# Altium schematic sheet CORE.SchDoc
size A3
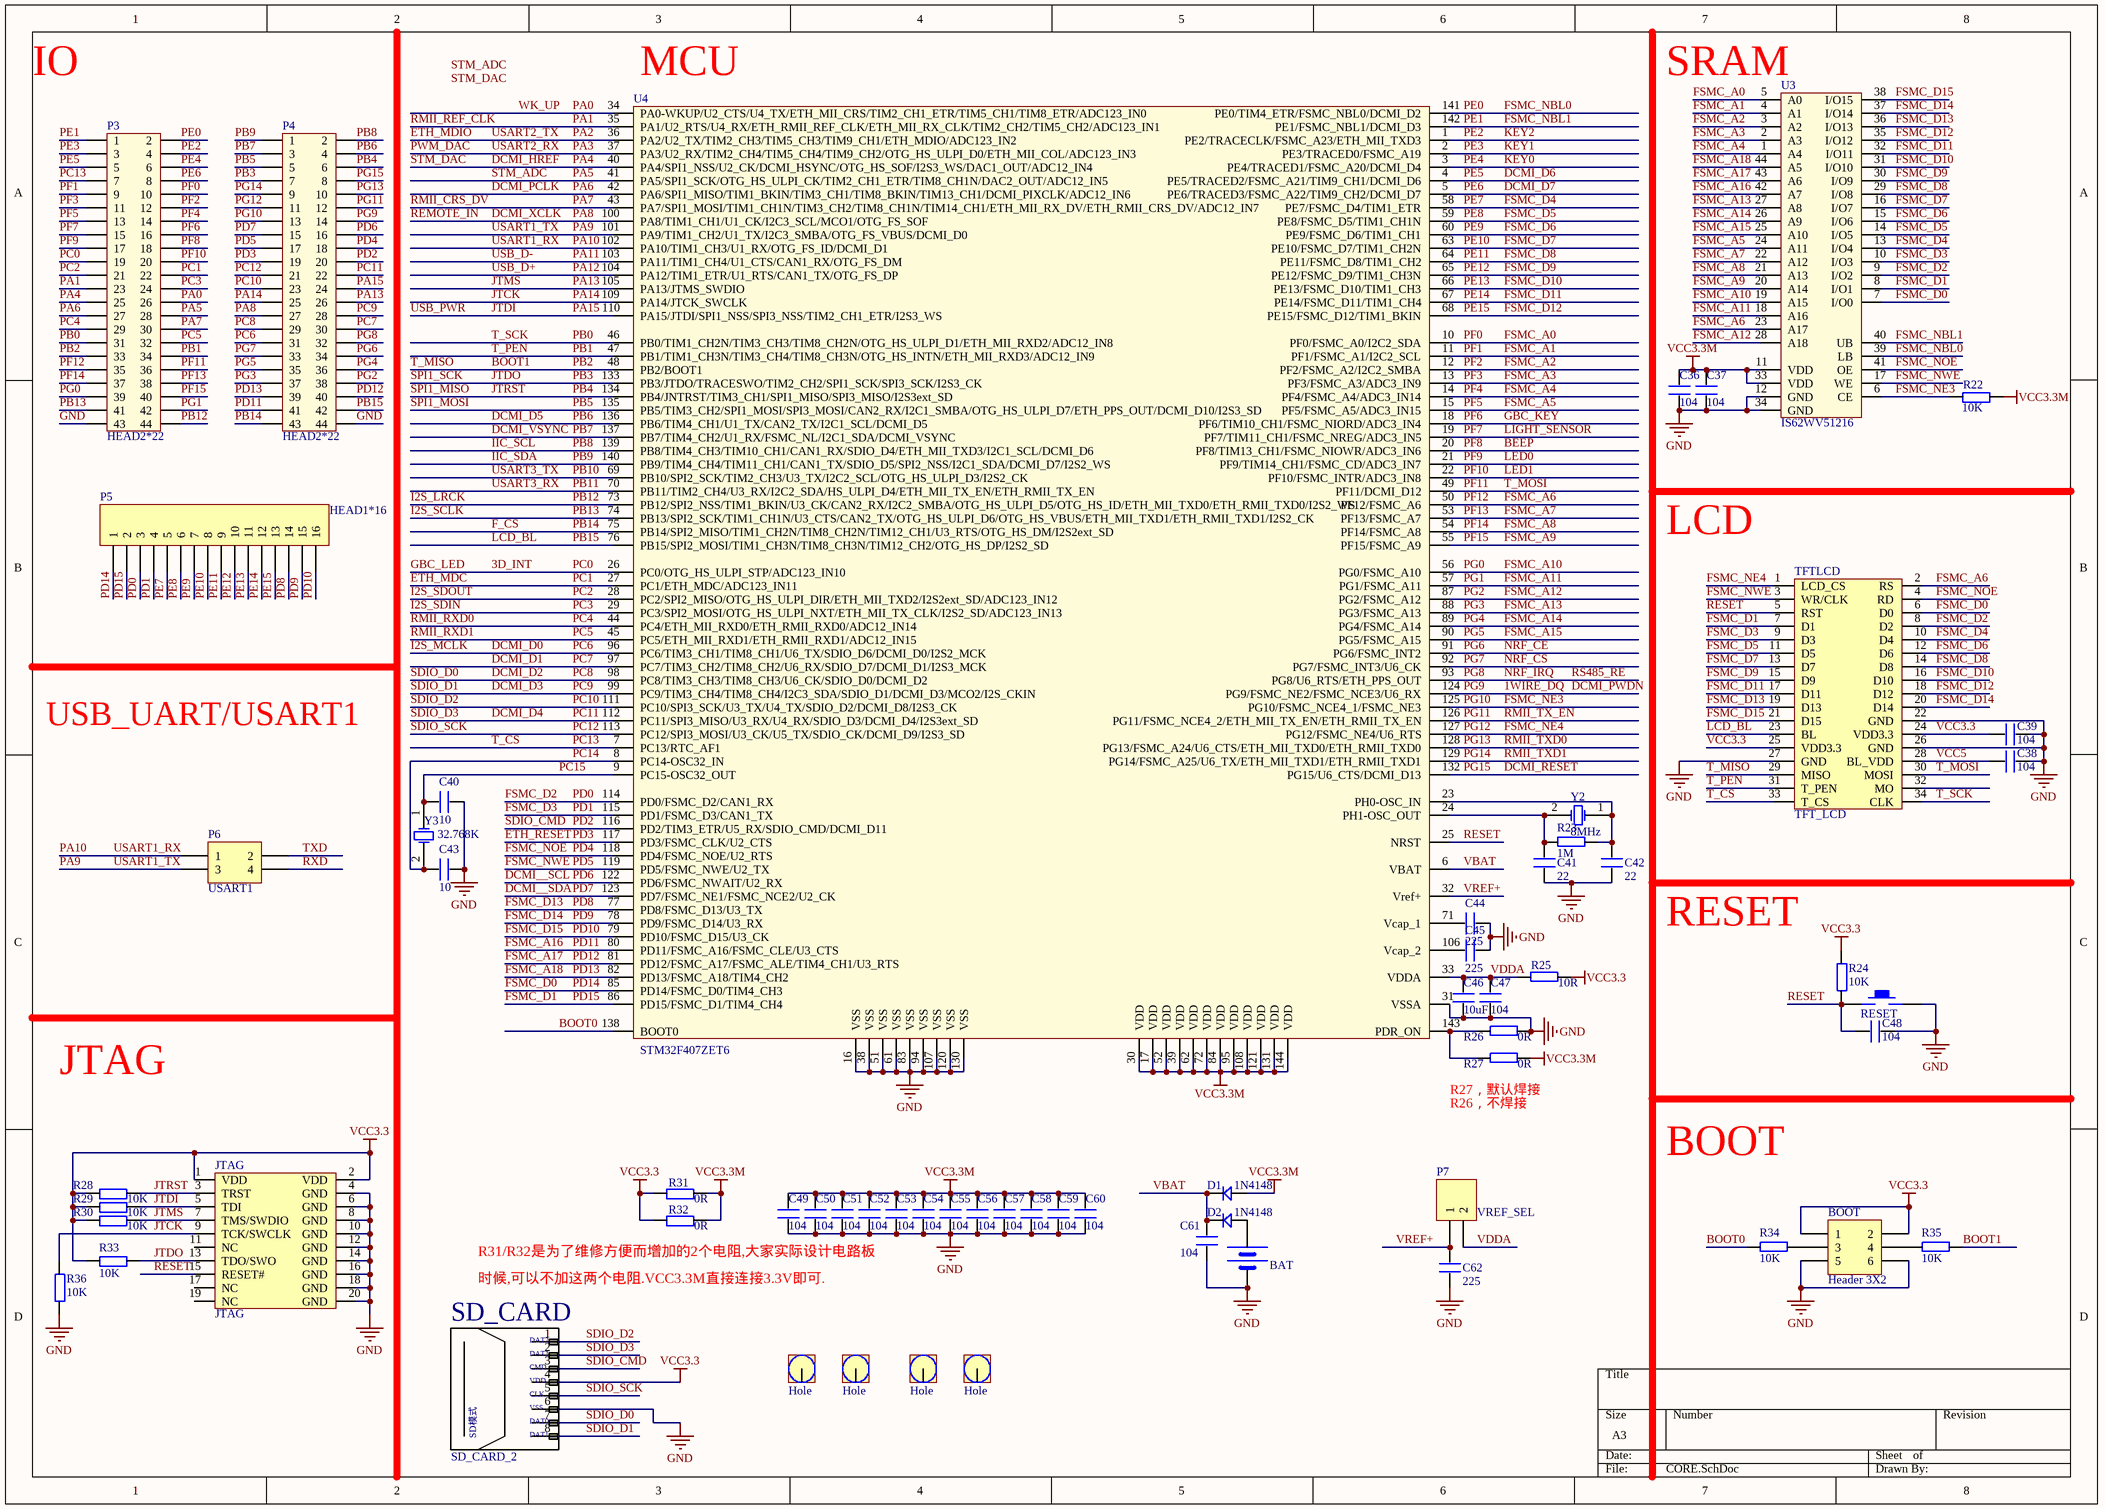
[diagram p0: CORE.SchDoc]

## Parts
BAT  BATT  [BATM]  (value not drawn)
BOOT  Header 3X2  [HDR2X3]
C36  104  [R0603]
C37  104  [R0603]
C38  104  [R0603]
C39  104  [R0603]
C40  10  [R0603]
C41  22  [R0603]
C42  22  [R0603]
C43  10  [R0603]
C44  225  [R0603]
C45  225  [R0603]
C46  10uF  [1206]
C47  104  [R0603]
C48  104  [R0603]
C49  104  [R0603]
C50  104  [R0603]
C51  104  [R0603]
C52  104  [R0603]
C53  104  [R0603]
C54  104  [R0603]
C55  104  [R0603]
C56  104  [R0603]
C57  104  [R0603]
C58  104  [R0603]
C59  104  [R0603]
C60  104  [R0603]
C61  104  [R0603]
C62  225  [R0603]
D1  1N4148  [DIODE_SOP]
D2  1N4148  [DIODE_SOP]
H1  Hole  [Hole_4.3Y]
H2  Hole  [Hole_4.3Y]
H3  Hole  [Hole_4.3Y]
H4  Hole  [Hole_4.3Y]
JTAG  JTAG  [JTAG_20]
P3  HEAD2*22  [HEAD2*22]
P4  HEAD2*22  [HEAD2*22]
P5  HEAD1*16  [HDR1X16]
P6  USART1  [HDR2X2]
P7  VREF_SEL  [HDR1X2]
R22  10K  [R0603]
R23  1M  [R0603]
R24  10K  [R0603]
R25  10R  [R0603]
R26  0R  [R0603]
R27  0R  [R0603]
R28  10K  [R0603]
R29  10K  [R0603]
R30  10K  [R0603]
R31  0R  [R0603]
R32  0R  [R0603]
R33  10K  [R0603]
R34  10K  [R0603]
R35  10K  [R0603]
R36  10K  [R0603]
RESET  KEY_M  [KEY_M]  (value not drawn)
SD_CARD_2  存储器接口  [TF_CARD_2]  (value not drawn)
TFTLCD  TFT_LCD  [db2*17-4.3]
U3  IS62WV51216  [TSOP44]
U4  STM32F407ZET6  [LQFP144]
Y2  8MHz  [XTAL_US]
Y3  32.768K  [XTAL32]

## Nets
GND: BAT.2(GND) BOOT.5 BOOT.6 C36.2 C37.2 C38.2 C39.2 C40.1 C41.2 C42.2 C43.1 C44.2 C45.2 C46.1 C47.1 C48.1 C49.1 C50.1 C51.1 C52.1 C53.1 C54.1 C55.1 C56.1 C57.1 C58.1 C59.1 C60.1 C61.2 C62.2 JTAG.4(GND) JTAG.6(GND) JTAG.8(GND) JTAG.10(GND) JTAG.12(GND) JTAG.14(GND) JTAG.16(GND) JTAG.18(GND) JTAG.20(GND) P3.43 P4.44 R26.1 R36.1 RESET.2 SD_CARD_2.6(VSS) TFTLCD.22(GND) TFTLCD.26(GND) TFTLCD.27(GND) U3.12(GND) U3.34(GND) U4.16(VSS) U4.31(VSSA) U4.38(VSS) U4.51(VSS) U4.61(VSS) U4.83(VSS) U4.94(VSS) U4.107(VSS) U4.120(VSS) U4.130(VSS)
VCC3.3: BOOT.1 BOOT.2 C39.1 JTAG.1(VDD) JTAG.2(VDD) R24.2 R25.1 R28.1 R29.1 R30.1 R31.1 R32.1 R33.1 SD_CARD_2.4(VDD) TFTLCD.24(VDD3.3) TFTLCD.25(VDD3.3)
VCC3.3M: C36.1 C37.1 C49.2 C50.2 C51.2 C52.2 C53.2 C54.2 C55.2 C56.2 C57.2 C58.2 C59.2 C60.2 D1.1 R22.2 R27.1 R31.2 R32.2 U3.11(VDD) U3.33(VDD) U4.17(VDD) U4.30(VDD) U4.39(VDD) U4.52(VDD) U4.62(VDD) U4.72(VDD) U4.84(VDD) U4.95(VDD) U4.108(VDD) U4.121(VDD) U4.131(VDD) U4.144(VDD)
1WIRE_DQ: P4.14 U4.124(PG9/FSMC_NE2/FSMC_NCE3/U6_RX)  [also labelled DCMI_PWDN, PG9]
3D_INT: P3.19 U4.26(PC0/OTG_HS_ULPI_STP/ADC123_IN10)  [also labelled GBC_LED, PC0]
BEEP: P3.18 U4.20(PF8/TIM13_CH1/FSMC_NIOWR/ADC3_IN6)  [also labelled PF8]
BOOT0: R34.2 U4.138(BOOT0)
BOOT1: P3.33 R35.1 TFTLCD.29(MISO) U4.48(PB2/BOOT1)  [also labelled PB2, T_MISO]
DCMI__SCL: P4.16 U4.122(PD6/FSMC_NWAIT/U2_RX)  [also labelled PD6]
DCMI__SDA: P4.15 U4.123(PD7/FSMC_NE1/FSMC_NCE2/U2_CK)  [also labelled PD7]
DCMI_D0: P4.31 U4.96(PC6/TIM3_CH1/TIM8_CH1/U6_TX/SDIO_D6/DCMI_D0/I2S2_MCK)  [also labelled I2S_MCLK, PC6]
DCMI_D1: P4.30 U4.97(PC7/TIM3_CH2/TIM8_CH2/U6_RX/SDIO_D7/DCMI_D1/I2S3_MCK)  [also labelled PC7]
DCMI_D2: P4.29 SD_CARD_2.7(DAT0/DO) U4.98(PC8/TIM3_CH3/TIM8_CH3/U6_CK/SDIO_D0/DCMI_D2)  [also labelled PC8, SDIO_D0]
DCMI_D3: P4.28 SD_CARD_2.8(DAT1/X) U4.99(PC9/TIM3_CH4/TIM8_CH4/I2C3_SDA/SDIO_D1/DCMI_D3/MCO2/I2S_CKIN)  [also labelled PC9, SDIO_D1]
DCMI_D4: P4.22 SD_CARD_2.2(CD/DAT3/CS) U4.112(PC11/SPI3_MISO/U3_RX/U4_RX/SDIO_D3/DCMI_D4/I2S3ext_SD)  [also labelled PC11, SDIO_D3]
DCMI_D5: P4.4 U4.136(PB6/TIM4_CH1/U1_TX/CAN2_TX/I2C1_SCL/DCMI_D5)  [also labelled PB6]
DCMI_D6: P3.5 U4.4(PE5/TRACED2/FSMC_A21/TIM9_CH1/DCMI_D6)  [also labelled PE5]
DCMI_D7: P3.8 U4.5(PE6/TRACED3/FSMC_A22/TIM9_CH2/DCMI_D7)  [also labelled PE6]
DCMI_HREF: P3.25 U4.40(PA4/SPI1_NSS/U2_CK/DCMI_HSYNC/OTG_HS_SOF/I2S3_WS/DAC1_OUT/ADC12_IN4)  [also labelled PA4, STM_DAC]
DCMI_PCLK: P3.27 U4.42(PA6/SPI1_MISO/TIM1_BKIN/TIM3_CH1/TIM8_BKIN/TIM13_CH1/DCMI_PIXCLK/ADC12_IN6)  [also labelled PA6]
DCMI_RESET: P4.8 U4.132(PG15/U6_CTS/DCMI_D13)  [also labelled PG15]
DCMI_VSYNC: P4.3 U4.137(PB7/TIM4_CH2/U1_RX/FSMC_NL/I2C1_SDA/DCMI_VSYNC)  [also labelled PB7]
DCMI_XCLK: P4.27 U4.100(PA8/TIM1_CH1/U1_CK/I2C3_SCL/MCO1/OTG_FS_SOF)  [also labelled PA8, REMOTE_IN]
ETH_MDC: P3.22 U4.27(PC1/ETH_MDC/ADC123_IN11)  [also labelled PC1]
ETH_MDIO: U4.36(PA2/U2_TX/TIM2_CH3/TIM5_CH3/TIM9_CH1/ETH_MDIO/ADC123_IN2)  [also labelled PA2, USART2_TX]
ETH_RESET: P4.19 U4.117(PD3/FSMC_CLK/U2_CTS)  [also labelled PD3]
F_CS: P4.43 U4.75(PB14/SPI2_MISO/TIM1_CH2N/TIM8_CH2N/TIM12_CH1/U3_RTS/OTG_HS_DM/I2S2ext_SD)  [also labelled PB14]
FSMC_A0: P3.10 U3.5(A0) U4.10(PF0/FSMC_A0/I2C2_SDA)  [also labelled PF0]
FSMC_A1: P3.9 U3.4(A1) U4.11(PF1/FSMC_A1/I2C2_SCL)  [also labelled PF1]
FSMC_A2: P3.12 U3.3(A2) U4.12(PF2/FSMC_A2/I2C2_SMBA)  [also labelled PF2]
FSMC_A3: P3.11 U3.2(A3) U4.13(PF3/FSMC_A3/ADC3_IN9)  [also labelled PF3]
FSMC_A4: P3.14 U3.1(A4) U4.14(PF4/FSMC_A4/ADC3_IN14)  [also labelled PF4]
FSMC_A5: P3.13 U3.24(A11) U4.15(PF5/FSMC_A5/ADC3_IN15)  [also labelled PF5]
FSMC_A6: P3.35 TFTLCD.2(RS) U3.23(A17) U4.50(PF12/FSMC_A6)  [also labelled PF12]
FSMC_A7: P3.38 U3.22(A12) U4.53(PF13/FSMC_A7)  [also labelled PF13]
FSMC_A8: P3.37 U3.21(A13) U4.54(PF14/FSMC_A8)  [also labelled PF14]
FSMC_A9: P3.40 U3.20(A14) U4.55(PF15/FSMC_A9)  [also labelled PF15]
FSMC_A10: P3.39 U3.19(A15) U4.56(PG0/FSMC_A10)  [also labelled PG0]
FSMC_A11: P3.42 U3.18(A16) U4.57(PG1/FSMC_A11)  [also labelled PG1]
FSMC_A12: P4.38 U3.28(A18) U4.87(PG2/FSMC_A12)  [also labelled PG2]
FSMC_A13: P4.37 U3.27(A8) U4.88(PG3/FSMC_A13)  [also labelled PG3]
FSMC_A14: P4.36 U3.26(A9) U4.89(PG4/FSMC_A14)  [also labelled PG4]
FSMC_A15: P4.35 U3.25(A10) U4.90(PG5/FSMC_A15)  [also labelled PG5]
FSMC_A16: P4.41 U3.42(A7) U4.80(PD11/FSMC_A16/FSMC_CLE/U3_CTS)  [also labelled PD11]
FSMC_A17: P4.40 U3.43(A6) U4.81(PD12/FSMC_A17/FSMC_ALE/TIM4_CH1/U3_RTS)  [also labelled PD12]
FSMC_A18: P4.39 U3.44(A5) U4.82(PD13/FSMC_A18/TIM4_CH2)  [also labelled PD13]
FSMC_D0: P5.1 TFTLCD.6(D0) U3.7(I/O0) U4.85(PD14/FSMC_D0/TIM4_CH3)  [also labelled PD14]
FSMC_D1: P5.2 TFTLCD.7(D1) U3.8(I/O1) U4.86(PD15/FSMC_D1/TIM4_CH4)  [also labelled PD15]
FSMC_D2: P5.3 TFTLCD.8(D2) U3.9(I/O2) U4.114(PD0/FSMC_D2/CAN1_RX)  [also labelled PD0]
FSMC_D3: P5.4 TFTLCD.9(D3) U3.10(I/O3) U4.115(PD1/FSMC_D3/CAN1_TX)  [also labelled PD1]
FSMC_D4: P5.5 TFTLCD.10(D4) U3.13(I/O4) U4.58(PE7/FSMC_D4/TIM1_ETR)  [also labelled PE7]
FSMC_D5: P5.6 TFTLCD.11(D5) U3.14(I/O5) U4.59(PE8/FSMC_D5/TIM1_CH1N)  [also labelled PE8]
FSMC_D6: P5.7 TFTLCD.12(D6) U3.15(I/O6) U4.60(PE9/FSMC_D6/TIM1_CH1)  [also labelled PE9]
FSMC_D7: P5.8 TFTLCD.13(D7) U3.16(I/O7) U4.63(PE10/FSMC_D7/TIM1_CH2N)  [also labelled PE10]
FSMC_D8: P5.9 TFTLCD.14(D8) U3.29(I/O8) U4.64(PE11/FSMC_D8/TIM1_CH2)  [also labelled PE11]
FSMC_D9: P5.10 TFTLCD.15(D9) U3.30(I/O9) U4.65(PE12/FSMC_D9/TIM1_CH3N)  [also labelled PE12]
FSMC_D10: P5.11 TFTLCD.16(D10) U3.31(I/O10) U4.66(PE13/FSMC_D10/TIM1_CH3)  [also labelled PE13]
FSMC_D11: P5.12 TFTLCD.17(D11) U3.32(I/O11) U4.67(PE14/FSMC_D11/TIM1_CH4)  [also labelled PE14]
FSMC_D12: P5.13 TFTLCD.18(D12) U3.35(I/O12) U4.68(PE15/FSMC_D12/TIM1_BKIN)  [also labelled PE15]
FSMC_D13: P5.14 TFTLCD.19(D13) U3.36(I/O13) U4.77(PD8/FSMC_D13/U3_TX)  [also labelled PD8]
FSMC_D14: P5.15 TFTLCD.20(D14) U3.37(I/O14) U4.78(PD9/FSMC_D14/U3_RX)  [also labelled PD9]
FSMC_D15: P5.16 TFTLCD.21(D15) U3.38(I/O15) U4.79(PD10/FSMC_D15/U3_CK)  [also labelled PD10]
FSMC_NBL0: P3.2 U3.39(LB) U4.141(PE0/TIM4_ETR/FSMC_NBL0/DCMI_D2)  [also labelled PE0]
FSMC_NBL1: P3.1 U3.40(UB) U4.142(PE1/FSMC_NBL1/DCMI_D3)  [also labelled PE1]
FSMC_NE3: P4.13 R22.1 U3.6(CE) U4.125(PG10/FSMC_NCE4_1/FSMC_NE3)  [also labelled PG10]
FSMC_NE4: P4.11 TFTLCD.1(LCD_CS) U4.127(PG12/FSMC_NE4/U6_RTS)  [also labelled PG12]
FSMC_NOE: P4.18 TFTLCD.4(RD) U3.41(OE) U4.118(PD4/FSMC_NOE/U2_RTS)  [also labelled PD4]
FSMC_NWE: P4.17 TFTLCD.3(WR/CLK) U3.17(WE) U4.119(PD5/FSMC_NWE/U2_TX)  [also labelled PD5]
GBC_KEY: P3.16 U4.18(PF6/TIM10_CH1/FSMC_NIORD/ADC3_IN4)  [also labelled PF6]
I2S_LRCK: P3.44 U4.73(PB12/SPI2_NSS/TIM1_BKIN/U3_CK/CAN2_RX/I2C2_SMBA/OTG_HS_ULPI_D5/OTG_HS_ID/ETH_MII_TXD0/ETH_RMII_TXD0/I2S2_WS)  [also labelled PB12]
I2S_SCLK: P3.41 U4.74(PB13/SPI2_SCK/TIM1_CH1N/U3_CTS/CAN2_TX/OTG_HS_ULPI_D6/OTG_HS_VBUS/ETH_MII_TXD1/ETH_RMII_TXD1/I2S2_CK)  [also labelled PB13]
I2S_SDIN: P3.24 U4.29(PC3/SPI2_MOSI/OTG_HS_ULPI_NXT/ETH_MII_TX_CLK/I2S2_SD/ADC123_IN13)  [also labelled PC3]
I2S_SDOUT: P3.21 U4.28(PC2/SPI2_MISO/OTG_HS_ULPI_DIR/ETH_MII_TXD2/I2S2ext_SD/ADC123_IN12)  [also labelled PC2]
IIC_SCL: P4.2 U4.139(PB8/TIM4_CH3/TIM10_CH1/CAN1_RX/SDIO_D4/ETH_MII_TXD3/I2C1_SCL/DCMI_D6)  [also labelled PB8]
IIC_SDA: P4.1 U4.140(PB9/TIM4_CH4/TIM11_CH1/CAN1_TX/SDIO_D5/SPI2_NSS/I2C1_SDA/DCMI_D7/I2S2_WS)  [also labelled PB9]
JTCK: JTAG.9(TCK/SWCLK) P4.25 R36.2 U4.109(PA14/JTCK_SWCLK)  [also labelled PA14]
JTDI: JTAG.5(TDI) P4.24 R29.2 U4.110(PA15/JTDI/SPI1_NSS/SPI3_NSS/TIM2_CH1_ETR/I2S3_WS)  [also labelled PA15, USB_PWR]
JTDO: JTAG.13(TDO/SWO) P4.7 R33.2 U4.133(PB3/JTDO/TRACESWO/TIM2_CH2/SPI1_SCK/SPI3_SCK/I2S3_CK)  [also labelled PB3, SPI1_SCK]
JTMS: JTAG.7(TMS/SWDIO) P4.26 R30.2 U4.105(PA13/JTMS_SWDIO)  [also labelled PA13]
JTRST: JTAG.3(TRST) P4.6 R28.2 U4.134(PB4/JNTRST/TIM3_CH1/SPI1_MISO/SPI3_MISO/I2S3ext_SD)  [also labelled PB4, SPI1_MISO]
KEY0: P3.6 U4.3(PE4/TRACED1/FSMC_A20/DCMI_D4)  [also labelled PE4]
KEY1: P3.3 U4.2(PE3/TRACED0/FSMC_A19)  [also labelled PE3]
KEY2: P3.4 U4.1(PE2/TRACECLK/FSMC_A23/ETH_MII_TXD3)  [also labelled PE2]
LCD_BL: P4.42 TFTLCD.23(BL) U4.76(PB15/SPI2_MOSI/TIM1_CH3N/TIM8_CH3N/TIM12_CH2/OTG_HS_DP/I2S2_SD)  [also labelled PB15]
LED0: P3.17 U4.21(PF9/TIM14_CH1/FSMC_CD/ADC3_IN7)  [also labelled PF9]
LED1: P3.20 U4.22(PF10/FSMC_INTR/ADC3_IN8)  [also labelled PF10]
LIGHT_SENSOR: P3.15 U4.19(PF7/TIM11_CH1/FSMC_NREG/ADC3_IN5)  [also labelled PF7]
NRF_CE: P4.34 U4.91(PG6/FSMC_INT2)  [also labelled PG6]
NRF_CS: P4.33 U4.92(PG7/FSMC_INT3/U6_CK)  [also labelled PG7]
NRF_IRQ: P4.32 U4.93(PG8/U6_RTS/ETH_PPS_OUT)  [also labelled PG8, RS485_RE]
PA0: P3.26 U4.34(PA0-WKUP/U2_CTS/U4_TX/ETH_MII_CRS/TIM2_CH1_ETR/TIM5_CH1/TIM8_ETR/ADC123_IN0)  [also labelled WK_UP]
PA1: P3.23 U4.35(PA1/U2_RTS/U4_RX/ETH_RMII_REF_CLK/ETH_MII_RX_CLK/TIM2_CH2/TIM5_CH2/ADC123_IN1)  [also labelled RMII_REF_CLK]
PA3: U4.37(PA3/U2_RX/TIM2_CH4/TIM5_CH4/TIM9_CH2/OTG_HS_ULPI_D0/ETH_MII_COL/ADC123_IN3)  [also labelled PWM_DAC, USART2_RX]
PA5: P3.28 U4.41(PA5/SPI1_SCK/OTG_HS_ULPI_CK/TIM2_CH1_ETR/TIM8_CH1N/DAC2_OUT/ADC12_IN5)  [also labelled STM_ADC]
PA7: P3.30 U4.43(PA7/SPI1_MOSI/TIM1_CH1N/TIM3_CH2/TIM8_CH1N/TIM14_CH1/ETH_MII_RX_DV/ETH_RMII_CRS_DV/ADC12_IN7)  [also labelled RMII_CRS_DV]
PA9: P6.3 U4.101(PA9/TIM1_CH2/U1_TX/I2C3_SMBA/OTG_FS_VBUS/DCMI_D0)  [also labelled USART1_TX]
PA10: P6.1 U4.102(PA10/TIM1_CH3/U1_RX/OTG_FS_ID/DCMI_D1)  [also labelled USART1_RX]
PA11: U4.103(PA11/TIM1_CH4/U1_CTS/CAN1_RX/OTG_FS_DM)  [also labelled USB_D-]
PA12: U4.104(PA12/TIM1_ETR/U1_RTS/CAN1_TX/OTG_FS_DP)  [also labelled USB_D+]
PB0: P3.31 TFTLCD.34(CLK) U4.46(PB0/TIM1_CH2N/TIM3_CH3/TIM8_CH2N/OTG_HS_ULPI_D1/ETH_MII_RXD2/ADC12_IN8)  [also labelled T_SCK]
PB1: P3.34 TFTLCD.31(T_PEN) U4.47(PB1/TIM1_CH3N/TIM3_CH4/TIM8_CH3N/OTG_HS_INTN/ETH_MII_RXD3/ADC12_IN9)  [also labelled T_PEN]
PB5: P4.5 U4.135(PB5/TIM3_CH2/SPI1_MOSI/SPI3_MOSI/CAN2_RX/I2C1_SMBA/OTG_HS_ULPI_D7/ETH_PPS_OUT/DCMI_D10/I2S3_SD)  [also labelled SPI1_MOSI]
PB10: U4.69(PB10/SPI2_SCK/TIM2_CH3/U3_TX/I2C2_SCL/OTG_HS_ULPI_D3/I2S2_CK)  [also labelled USART3_TX]
PB11: U4.70(PB11/TIM2_CH4/U3_RX/I2C2_SDA/HS_ULPI_D4/ETH_MII_TX_EN/ETH_RMII_TX_EN)  [also labelled USART3_RX]
PC4: P3.29 U4.44(PC4/ETH_MII_RXD0/ETH_RMII_RXD0/ADC12_IN14)  [also labelled RMII_RXD0]
PC5: P3.32 U4.45(PC5/ETH_MII_RXD1/ETH_RMII_RXD1/ADC12_IN15)  [also labelled RMII_RXD1]
PC10: P4.23 SD_CARD_2.1(DTA2/X) U4.111(PC10/SPI3_SCK/U3_TX/U4_TX/SDIO_D2/DCMI_D8/I2S3_CK)  [also labelled SDIO_D2]
PC12: P4.21 SD_CARD_2.5(CLK) U4.113(PC12/SPI3_MOSI/U3_CK/U5_TX/SDIO_CK/DCMI_D9/I2S3_SD)  [also labelled SDIO_SCK]
PC13: P3.7 TFTLCD.33(T_CS) U4.7(PC13/RTC_AF1)  [also labelled T_CS]
PC14: C43.2 U4.8(PC14-OSC32_IN) Y3.2(OSC2)
PC15: C40.2 U4.9(PC15-OSC32_OUT) Y3.1(OSC1)
PD2: P4.20 SD_CARD_2.3(CMD/DI) U4.116(PD2/TIM3_ETR/U5_RX/SDIO_CMD/DCMI_D11)  [also labelled SDIO_CMD]
PF11: P3.36 TFTLCD.30(MOSI) U4.49(PF11/DCMI_D12)  [also labelled T_MOSI]
PG11: P4.12 U4.126(PG11/FSMC_NCE4_2/ETH_MII_TX_EN/ETH_RMII_TX_EN)  [also labelled RMII_TX_EN]
PG13: P4.10 U4.128(PG13/FSMC_A24/U6_CTS/ETH_MII_TXD0/ETH_RMII_TXD0)  [also labelled RMII_TXD0]
PG14: P4.9 U4.129(PG14/FSMC_A25/U6_TX/ETH_MII_TXD1/ETH_RMII_TXD1)  [also labelled RMII_TXD1]
RESET: C48.2 JTAG.15(RESET#) R24.1 RESET.1 TFTLCD.5(RST) U4.25(NRST)
RXD: P6.4
TXD: P6.2
VBAT: C61.1 D1.2 D2.2 U4.6(VBAT)
VCC5: C38.1 TFTLCD.28(BL_VDD)
VDDA: C46.2 C47.2 P7.2 R25.2 U4.33(VDDA)
VREF+: C62.1 P7.1 U4.32(Vref+)
NetBAT_1: BAT.1(VCC) D2.1
NetBOOT_3: BOOT.3 R34.1
NetBOOT_4: BOOT.4 R35.2
NetC41_1: C41.1 R23.2 U4.24(PH1-OSC_OUT) Y2.2(OSC2)
NetC42_1: C42.1 R23.1 U4.23(PH0-OSC_IN) Y2.1(OSC1)
NetC44_1: C44.1 U4.71(Vcap_1)
NetC45_1: C45.1 U4.106(Vcap_2)
NetR26_2: R26.2 R27.2 U4.143(PDR_ON)

Not connected (* = marked no-connect by the designer): H1 1; H2 1; H3 1; H4 1; JTAG 11(NC) 17(NC) 19(NC); TFTLCD 32(MO)

## Notes on the sheet
- IO
- (near U4) MCU
- (near U3) SRAM
- LCD
- USB_UART/USART1
- RESET
- JTAG
- (near R27) R27，默认焊接
- R26，不焊接
- BOOT
- (near R32) R31/R32是为了维修方便而增加的2个电阻,大家实际设计电路板
- (near SD_CARD_2) SD_CARD
- 时候,可以不加这两个电阻.VCC3.3M直接连接3.3V即可.
- Labels drawn without touching a wire or pin: STM_ADC, STM_DAC
- (in symbol TF) DAT2; DAT3; CMD; SD模式; DAT0; DAT1

## Library data of the parts
BAT = BAT
BOOT = Header 3X2: Header, 3-Pin, Dual row; LatestRevisionDate: 17-Jul-2002; LatestRevisionNote: Re-released for DXP Platform.; Publisher: Altium Limited
C36-C62 = C
D1 D2 = D
P5 = Header 16: Header, 16-Pin; LatestRevisionDate: 17-Jul-2002; LatestRevisionNote: Re-released for DXP Platform.; Publisher: Altium Limited
P6 = Header 2X2: Header, 2-Pin, Dual row; LatestRevisionDate: 17-Jul-2002; LatestRevisionNote: Re-released for DXP Platform.; Publisher: Altium Limited
P7 = Header 2: Header, 2-Pin; LatestRevisionDate: 17-Jul-2002; LatestRevisionNote: Re-released for DXP Platform.; Publisher: Altium Limited
R22-R36 = R
SD_CARD_2 = TF: TF存储器卡槽
Y2 = XTAL: Crystal Oscillator; Published: 8-Jun-2000; LatestRevisionDate: 17-Jul-2002; LatestRevisionNote: Re-released for DXP Platform.; Publisher: Altium Limited
Y3 = XTAL_1: Crystal Oscillator; Published: 8-Jun-2000; LatestRevisionDate: 17-Jul-2002; LatestRevisionNote: Re-released for DXP Platform.; Publisher: Altium Limited